# Altium schematic sheet etapa4.SchDoc
size Letter
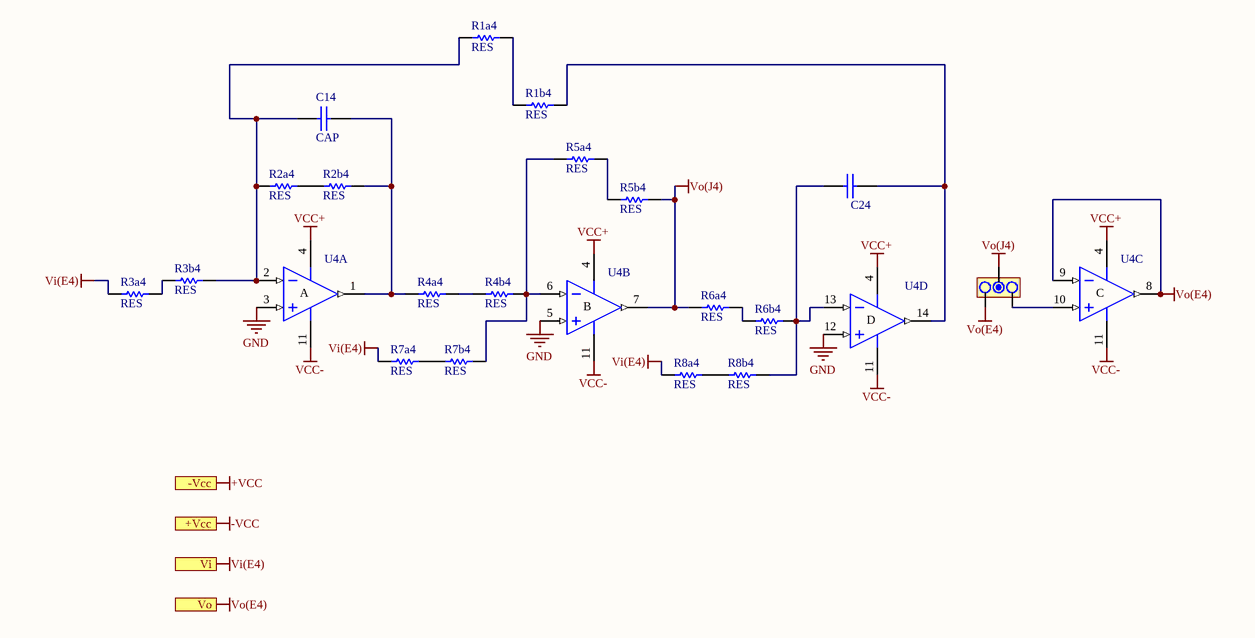
[diagram p0: etapa4.SchDoc]

## Parts
C14  CAP  [CAP200]
C24  CAP  [CAP200]  (value not drawn)
Jumper4  JUMPER  [JUMPER3]  (value not drawn)
R1a4  RES  [0805]
R1b4  RES  [0805]
R2a4  RES  [0805]
R2b4  RES  [0805]
R3a4  RES  [0805]
R3b4  RES  [0805]
R4a4  RES  [0805]
R4b4  RES  [0805]
R5a4  RES  [0805]
R5b4  RES  [0805]
R6a4  RES  [0805]
R6b4  RES  [0805]
R7a4  RES  [0805]
R7b4  RES  [0805]
R8a4  RES  [0805]
R8b4  RES  [0805]
U4  TL084N  [N014]  (value not drawn)  (parts A,B,C,D of 4)

## Ports
+Vcc, -Vcc, Vi, Vo

## Nets
+VCC: port -Vcc
-VCC: port +Vcc
GND: U4.3(IN+) U4.5(IN+) U4.12(IN+)
VCC+: U4.4(V+)
VCC-: U4.11(V-)
Vi(E4): R3a4.1 R7a4.1 R8a4.1 ; port Vi
Vo(E4): Jumper4.3 U4.8(OUT) U4.9(IN-) ; port Vo
Vo(J4): Jumper4.2 R5b4.2 R6a4.1 U4.7(OUT)
NetC14_1: C14.1 R1a4.1 R2a4.1 R3b4.2 U4.2(IN-)
NetC14_2: C14.2 R2b4.2 R4a4.1 U4.1(OUT)
NetC24_1: C24.1 R6b4.2 R8b4.2 U4.13(IN-)
NetC24_2: C24.2 R1b4.2 U4.14(OUT)
NetJumper4_1: Jumper4.1 U4.10(IN+)
NetR1a4_2: R1a4.2 R1b4.1
NetR2a4_2: R2a4.2 R2b4.1
NetR3a4_2: R3a4.2 R3b4.1
NetR4a4_2: R4a4.2 R4b4.1
NetR4b4_2: R4b4.2 R5a4.1 R7b4.2 U4.6(IN-)
NetR5a4_2: R5a4.2 R5b4.1
NetR6a4_2: R6a4.2 R6b4.1
NetR7a4_2: R7a4.2 R7b4.1
NetR8a4_2: R8a4.2 R8b4.1

## Notes on the sheet
- (in symbol TL084N, part A) A
- (in symbol TL084N, part B) B
- (in symbol TL084N, part C) C
- (in symbol TL084N, part D) D

## Library data of the parts
Jumper4 = JUMPER3
U4 = TL084N: JFET-Input Operational Amplifier; Published: 16-Jan-2001; LatestRevisionDate: 04-Mar-2005; LatestRevisionNote: Stylized 3D Model Added.; DatasheetVersion: Feb-1999; PackageVersion: Oct-1995; PackageReference: N014; Publisher: Altium Limited; PackageDescription: DIP; 14 Leads; Row Spacing 7.62 mm; Pitch 2.54 mm; ComponentLink1Description: Manufacturer Link; ComponentLink1URL: http://www.ti.com/; ComponentLink2Description: Datasheet; ComponentLink2URL: http://www-s.ti.com/sc/ds/tl084.pdf